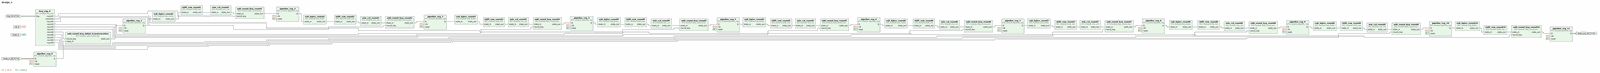
[diagram p0: block diagram of the top level, whole]
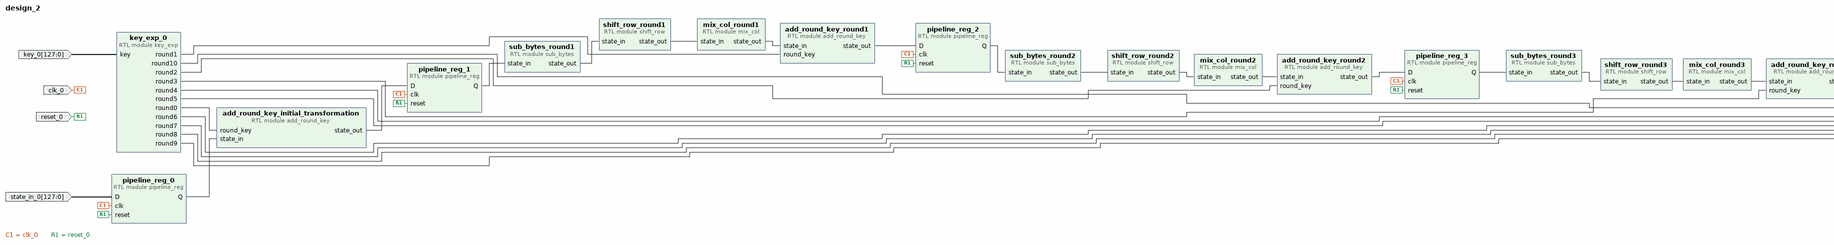
[diagram p1: block diagram of the top level, left part]
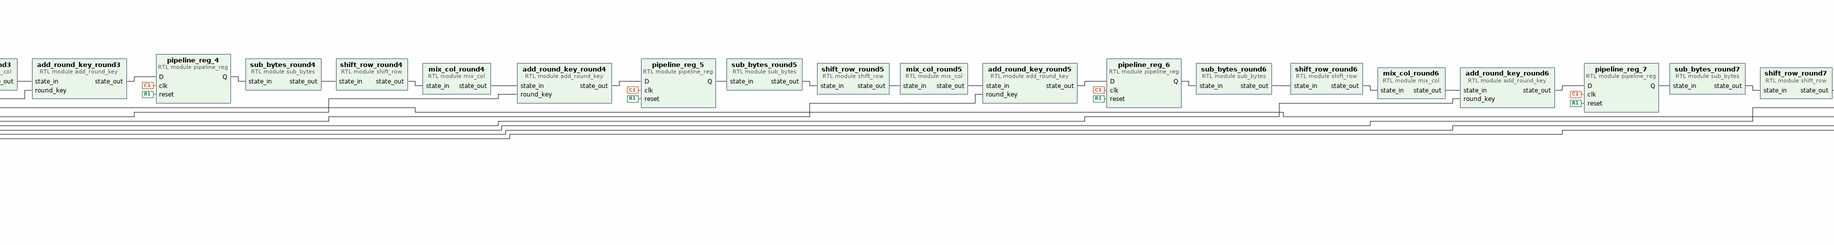
[diagram p2: block diagram of the top level, centre part]
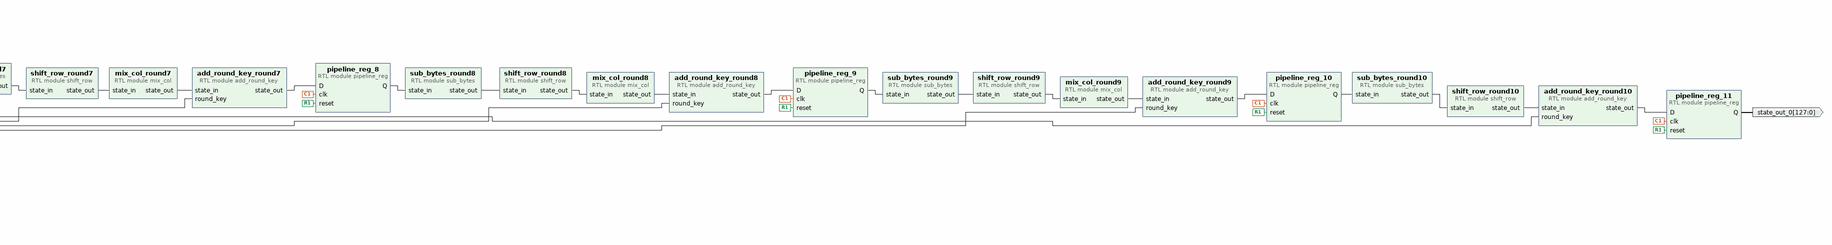
[diagram p3: block diagram of the top level, right part]
# Vivado block design design_2, xc7vx485tffg1157-1, Vivado 2020.2
create_bd_design design_2

create_bd_port -dir I -type clk clk_0
create_bd_port -dir I -from 127 -to 0 key_0
create_bd_port -dir I -type rst reset_0
create_bd_port -dir I -from 127 -to 0 state_in_0
create_bd_port -dir O -from 127 -to 0 state_out_0

create_bd_cell -type module -reference pipeline_reg pipeline_reg_0
create_bd_cell -type module -reference pipeline_reg pipeline_reg_1
create_bd_cell -type module -reference pipeline_reg pipeline_reg_10
create_bd_cell -type module -reference pipeline_reg pipeline_reg_11
create_bd_cell -type module -reference pipeline_reg pipeline_reg_2
create_bd_cell -type module -reference pipeline_reg pipeline_reg_3
create_bd_cell -type module -reference pipeline_reg pipeline_reg_4
create_bd_cell -type module -reference pipeline_reg pipeline_reg_5
create_bd_cell -type module -reference pipeline_reg pipeline_reg_6
create_bd_cell -type module -reference pipeline_reg pipeline_reg_7
create_bd_cell -type module -reference pipeline_reg pipeline_reg_8
create_bd_cell -type module -reference pipeline_reg pipeline_reg_9
create_bd_cell -type module -reference add_round_key add_round_key_initial_transformation
create_bd_cell -type module -reference add_round_key add_round_key_round10
create_bd_cell -type module -reference add_round_key add_round_key_round1
create_bd_cell -type module -reference add_round_key add_round_key_round2
create_bd_cell -type module -reference add_round_key add_round_key_round3
create_bd_cell -type module -reference add_round_key add_round_key_round4
create_bd_cell -type module -reference add_round_key add_round_key_round5
create_bd_cell -type module -reference add_round_key add_round_key_round6
create_bd_cell -type module -reference add_round_key add_round_key_round7
create_bd_cell -type module -reference add_round_key add_round_key_round8
create_bd_cell -type module -reference add_round_key add_round_key_round9
create_bd_cell -type module -reference shift_row shift_row_round10
create_bd_cell -type module -reference shift_row shift_row_round1
create_bd_cell -type module -reference shift_row shift_row_round2
create_bd_cell -type module -reference shift_row shift_row_round3
create_bd_cell -type module -reference shift_row shift_row_round4
create_bd_cell -type module -reference shift_row shift_row_round5
create_bd_cell -type module -reference shift_row shift_row_round6
create_bd_cell -type module -reference shift_row shift_row_round7
create_bd_cell -type module -reference shift_row shift_row_round8
create_bd_cell -type module -reference shift_row shift_row_round9
create_bd_cell -type module -reference mix_col mix_col_round1
create_bd_cell -type module -reference mix_col mix_col_round2
create_bd_cell -type module -reference mix_col mix_col_round3
create_bd_cell -type module -reference mix_col mix_col_round4
create_bd_cell -type module -reference mix_col mix_col_round5
create_bd_cell -type module -reference mix_col mix_col_round6
create_bd_cell -type module -reference mix_col mix_col_round7
create_bd_cell -type module -reference mix_col mix_col_round8
create_bd_cell -type module -reference mix_col mix_col_round9
create_bd_cell -type module -reference sub_bytes sub_bytes_round10
create_bd_cell -type module -reference sub_bytes sub_bytes_round1
create_bd_cell -type module -reference sub_bytes sub_bytes_round2
create_bd_cell -type module -reference sub_bytes sub_bytes_round3
create_bd_cell -type module -reference sub_bytes sub_bytes_round4
create_bd_cell -type module -reference sub_bytes sub_bytes_round5
create_bd_cell -type module -reference sub_bytes sub_bytes_round6
create_bd_cell -type module -reference sub_bytes sub_bytes_round7
create_bd_cell -type module -reference sub_bytes sub_bytes_round8
create_bd_cell -type module -reference sub_bytes sub_bytes_round9
create_bd_cell -type module -reference key_exp key_exp_0

# ---- connections ----

connect_bd_net [get_bd_pins add_round_key_initial_transformation/state_out] [get_bd_pins pipeline_reg_1/D]
connect_bd_net [get_bd_pins add_round_key_round10/state_out] [get_bd_pins pipeline_reg_11/D]
connect_bd_net [get_bd_pins add_round_key_round1/state_out] [get_bd_pins pipeline_reg_2/D]
connect_bd_net [get_bd_pins add_round_key_round2/state_out] [get_bd_pins pipeline_reg_3/D]
connect_bd_net [get_bd_pins add_round_key_round3/state_out] [get_bd_pins pipeline_reg_4/D]
connect_bd_net [get_bd_pins add_round_key_round4/state_out] [get_bd_pins pipeline_reg_5/D]
connect_bd_net [get_bd_pins add_round_key_round6/state_out] [get_bd_pins pipeline_reg_7/D]
connect_bd_net [get_bd_pins add_round_key_round7/state_out] [get_bd_pins pipeline_reg_8/D]
connect_bd_net [get_bd_pins add_round_key_round8/state_out] [get_bd_pins pipeline_reg_9/D]
connect_bd_net [get_bd_pins add_round_key_round9/state_out] [get_bd_pins pipeline_reg_10/D]
connect_bd_net -net clk_0_1 [get_bd_ports clk_0] \
  [get_bd_pins pipeline_reg_0/clk] [get_bd_pins pipeline_reg_1/clk] [get_bd_pins pipeline_reg_2/clk] \
  [get_bd_pins pipeline_reg_3/clk] [get_bd_pins pipeline_reg_4/clk] [get_bd_pins pipeline_reg_5/clk] \
  [get_bd_pins pipeline_reg_6/clk] [get_bd_pins pipeline_reg_7/clk] [get_bd_pins pipeline_reg_8/clk] \
  [get_bd_pins pipeline_reg_9/clk] [get_bd_pins pipeline_reg_10/clk] [get_bd_pins pipeline_reg_11/clk]
connect_bd_net -net key_0_1 [get_bd_ports key_0] [get_bd_pins key_exp_0/key]
connect_bd_net [get_bd_pins key_exp_0/round0] [get_bd_pins add_round_key_initial_transformation/round_key]
connect_bd_net [get_bd_pins key_exp_0/round1] [get_bd_pins add_round_key_round1/round_key]
connect_bd_net [get_bd_pins key_exp_0/round10] [get_bd_pins add_round_key_round10/round_key]
connect_bd_net [get_bd_pins key_exp_0/round2] [get_bd_pins add_round_key_round2/round_key]
connect_bd_net [get_bd_pins key_exp_0/round3] [get_bd_pins add_round_key_round3/round_key]
connect_bd_net [get_bd_pins key_exp_0/round4] [get_bd_pins add_round_key_round4/round_key]
connect_bd_net [get_bd_pins key_exp_0/round5] [get_bd_pins add_round_key_round5/round_key]
connect_bd_net [get_bd_pins key_exp_0/round6] [get_bd_pins add_round_key_round6/round_key]
connect_bd_net [get_bd_pins key_exp_0/round7] [get_bd_pins add_round_key_round7/round_key]
connect_bd_net [get_bd_pins key_exp_0/round8] [get_bd_pins add_round_key_round8/round_key]
connect_bd_net [get_bd_pins key_exp_0/round9] [get_bd_pins add_round_key_round9/round_key]
connect_bd_net -net mix_col_0_state_out [get_bd_pins mix_col_round1/state_out] [get_bd_pins add_round_key_round1/state_in]
connect_bd_net [get_bd_pins mix_col_round2/state_out] [get_bd_pins add_round_key_round2/state_in]
connect_bd_net [get_bd_pins mix_col_round3/state_out] [get_bd_pins add_round_key_round3/state_in]
connect_bd_net [get_bd_pins mix_col_round4/state_out] [get_bd_pins add_round_key_round4/state_in]
connect_bd_net [get_bd_pins mix_col_round5/state_out] [get_bd_pins add_round_key_round5/state_in]
connect_bd_net [get_bd_pins mix_col_round6/state_out] [get_bd_pins add_round_key_round6/state_in]
connect_bd_net [get_bd_pins mix_col_round7/state_out] [get_bd_pins add_round_key_round7/state_in]
connect_bd_net [get_bd_pins mix_col_round8/state_out] [get_bd_pins add_round_key_round8/state_in]
connect_bd_net [get_bd_pins mix_col_round9/state_out] [get_bd_pins add_round_key_round9/state_in]
connect_bd_net [get_bd_pins pipeline_reg_0/Q] [get_bd_pins add_round_key_initial_transformation/state_in]
connect_bd_net [get_bd_pins pipeline_reg_10/Q] [get_bd_pins sub_bytes_round10/state_in]
connect_bd_net [get_bd_pins pipeline_reg_11/Q] [get_bd_ports state_out_0]
connect_bd_net [get_bd_pins pipeline_reg_1/Q] [get_bd_pins sub_bytes_round1/state_in]
connect_bd_net [get_bd_pins pipeline_reg_2/Q] [get_bd_pins sub_bytes_round2/state_in]
connect_bd_net [get_bd_pins pipeline_reg_3/Q] [get_bd_pins sub_bytes_round3/state_in]
connect_bd_net [get_bd_pins pipeline_reg_4/Q] [get_bd_pins sub_bytes_round4/state_in]
connect_bd_net [get_bd_pins pipeline_reg_5/Q] [get_bd_pins sub_bytes_round5/state_in]
connect_bd_net [get_bd_pins pipeline_reg_6/Q] [get_bd_pins sub_bytes_round6/state_in]
connect_bd_net [get_bd_pins pipeline_reg_7/Q] [get_bd_pins sub_bytes_round7/state_in]
connect_bd_net [get_bd_pins pipeline_reg_8/Q] [get_bd_pins sub_bytes_round8/state_in]
connect_bd_net [get_bd_pins pipeline_reg_9/Q] [get_bd_pins sub_bytes_round9/state_in]
connect_bd_net -net reset_0_1 [get_bd_ports reset_0] \
  [get_bd_pins pipeline_reg_0/reset] [get_bd_pins pipeline_reg_1/reset] [get_bd_pins pipeline_reg_2/reset] \
  [get_bd_pins pipeline_reg_3/reset] [get_bd_pins pipeline_reg_4/reset] [get_bd_pins pipeline_reg_5/reset] \
  [get_bd_pins pipeline_reg_6/reset] [get_bd_pins pipeline_reg_7/reset] [get_bd_pins pipeline_reg_8/reset] \
  [get_bd_pins pipeline_reg_9/reset] [get_bd_pins pipeline_reg_10/reset] [get_bd_pins pipeline_reg_11/reset]
connect_bd_net -net shift_row_0_state_out [get_bd_pins shift_row_round1/state_out] [get_bd_pins mix_col_round1/state_in]
connect_bd_net [get_bd_pins shift_row_round10/state_out] [get_bd_pins add_round_key_round10/state_in]
connect_bd_net [get_bd_pins shift_row_round2/state_out] [get_bd_pins mix_col_round2/state_in]
connect_bd_net [get_bd_pins shift_row_round3/state_out] [get_bd_pins mix_col_round3/state_in]
connect_bd_net [get_bd_pins shift_row_round4/state_out] [get_bd_pins mix_col_round4/state_in]
connect_bd_net [get_bd_pins shift_row_round5/state_out] [get_bd_pins mix_col_round5/state_in]
connect_bd_net [get_bd_pins shift_row_round6/state_out] [get_bd_pins mix_col_round6/state_in]
connect_bd_net [get_bd_pins shift_row_round7/state_out] [get_bd_pins mix_col_round7/state_in]
connect_bd_net [get_bd_pins shift_row_round8/state_out] [get_bd_pins mix_col_round8/state_in]
connect_bd_net [get_bd_pins shift_row_round9/state_out] [get_bd_pins mix_col_round9/state_in]
connect_bd_net -net state_in_0_1 [get_bd_ports state_in_0] [get_bd_pins pipeline_reg_0/D]
connect_bd_net -net sub_bytes_0_state_out [get_bd_pins sub_bytes_round1/state_out] [get_bd_pins shift_row_round1/state_in]
connect_bd_net [get_bd_pins sub_bytes_round10/state_out] [get_bd_pins shift_row_round10/state_in]
connect_bd_net [get_bd_pins sub_bytes_round2/state_out] [get_bd_pins shift_row_round2/state_in]
connect_bd_net [get_bd_pins sub_bytes_round3/state_out] [get_bd_pins shift_row_round3/state_in]
connect_bd_net [get_bd_pins sub_bytes_round4/state_out] [get_bd_pins shift_row_round4/state_in]
connect_bd_net [get_bd_pins sub_bytes_round5/state_out] [get_bd_pins shift_row_round5/state_in]
connect_bd_net [get_bd_pins sub_bytes_round6/state_out] [get_bd_pins shift_row_round6/state_in]
connect_bd_net [get_bd_pins sub_bytes_round7/state_out] [get_bd_pins shift_row_round7/state_in]
connect_bd_net [get_bd_pins sub_bytes_round8/state_out] [get_bd_pins shift_row_round8/state_in]
connect_bd_net [get_bd_pins sub_bytes_round9/state_out] [get_bd_pins shift_row_round9/state_in]
connect_bd_net [get_bd_pins add_round_key_round5/state_out] [get_bd_pins pipeline_reg_6/D]

validate_bd_design
save_bd_design
